# Altium schematic sheet Battery Pack + Protection.SchDoc
size A; SheetNumber: 2; SheetTotal: 5
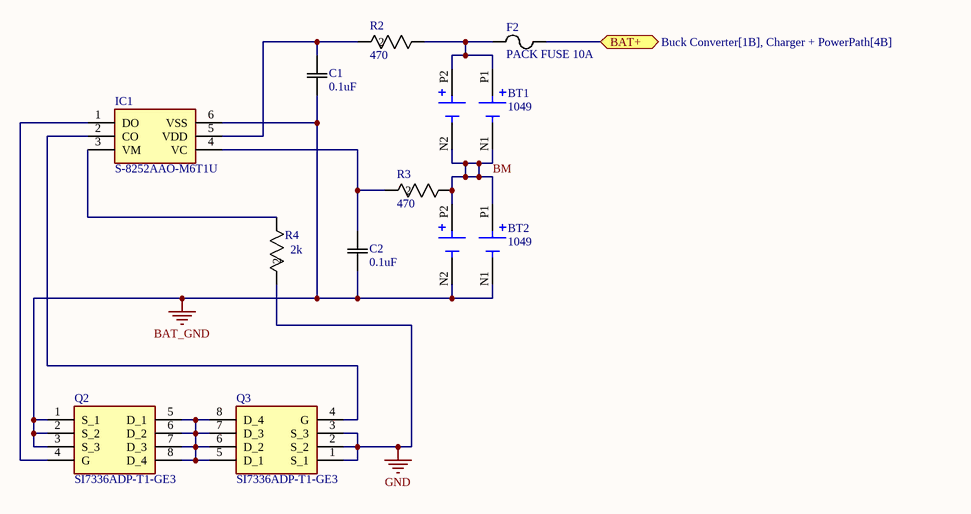
[diagram p0: Battery Pack + Protection.SchDoc]

## Parts
BT1  1049  [BAT_1049]
BT2  1049  [BAT_1049]
C1  0.1uF  [CAPC220145_88N_KEM]
C2  0.1uF  [CAPC220145_88N_KEM]
F2  PACK FUSE 10A  [FUSE_2920L70012_LTF]
IC1  S-8252AAO-M6T1U  [SOT95P275X135-6N]
Q2  SI7336ADP-T1-GE3  [SI7141DPT1GE3]
Q3  SI7336ADP-T1-GE3  [SI7141DPT1GE3]
R2  470  [RC0805N_YAG]
R3  470  [RC0805N_YAG]
R4  2k  [RC0805N_YAG]

## Ports
BAT+ (bidir, see Buck Converter[1B], Charger + PowerPath[4B])

## Nets
BAT_GND: BT2.N1(NEG1) BT2.N2(NEG2) C1.1 C2.1 IC1.6(VSS) Q2.1(S_1) Q2.2(S_2) Q2.3(S_3)
GND: Q3.1(S_1) Q3.2(S_2) Q3.3(S_3) R4.2
BAT+: F2.2 ; port BAT+
BM: BT1.N1(NEG1) BT1.N2(NEG2) BT2.P1(POS1) BT2.P2(POS2) R3.1
NetBT1_P1: BT1.P1(POS1) BT1.P2(POS2) F2.1 R2.1
NetC1_2: C1.2 IC1.5(VDD) R2.2
NetC2_2: C2.2 IC1.4(VC) R3.2
NetIC1_1: IC1.1(DO) Q2.4(G)
NetIC1_2: IC1.2(CO) Q3.4(G)
NetIC1_3: IC1.3(VM) R4.1
NetQ2_5: Q2.5(D_1) Q2.6(D_2) Q2.7(D_3) Q2.8(D_4) Q3.5(D_1) Q3.6(D_2) Q3.7(D_3) Q3.8(D_4)

## Library data of the parts
BT1 BT2 = 1049: THM Holder for Dual 18650 Batteries; MF: Keystone Electronics; SnapEDA_Link: https://www.snapeda.com/parts/1049/Keystone/view-part/?ref=snap; Package: None; Value: *; MP: 1049; Check_prices: https://www.snapeda.com/parts/1049/Keystone/view-part/?ref=eda
C1 C2 = C0805C104K5RACTU: SMD Comm X7R, Ceramic, 0.1 uF, 10%, 50 VDC, X7R, SMD, MLCC, Temperature Stable, Class II, 0805; Manufacturer_Name: Kemet; Copyright: Copyright (C) 2025 Ultra Librarian. All rights reserved.; Manufacturer_Part_Number: C0805C104K5RACTU
F2 = 2920L70012MR-A: Description; Manufacturer_Name: Littelfuse Inc; Manufacturer_Part_Number: 2920L700/12MR-A; Copyright: Copyright (C) 2025 Ultra Librarian. All rights reserved.
IC1 = S-8252AAO-M6T1U: Integrated Circuit; Manufacturer_Name: ABLIC Inc.; Datasheet Link: https://mouser.componentsearchengine.com/Datasheets/1/S-8252AAO-M6T1U.pdf; Height: 1.35mm; Manufacturer_Part_Number: S-8252AAO-M6T1U; Mouser Part Number: 628-S-8252AAO-M6T1U; Mouser Price/Stock: https://www.mouser.co.uk/ProductDetail/ABLIC/S-8252AAO-M6T1U?qs=Zq5ylnUbLm4MVa2IWcZcAw%3D%3D
Q2 Q3 = SI7336ADP-T1-GE3: MOSFET (N-Channel); Manufacturer_Name: Vishay; Datasheet Link: https://www.vishay.com/docs/73152/si7336adp.pdf; Manufacturer_Part_Number: SI7336ADP-T1-GE3; Mouser Part Number: 781-SI7336ADP-GE3; Mouser Price/Stock: https://www.mouser.co.uk/ProductDetail/Vishay-Semiconductors/SI7336ADP-T1-GE3?qs=rsuNcXF5LUYW4GWPNOtlwQ%3D%3D; Arrow Part Number: SI7336ADP-T1-GE3; Arrow Price/Stock: https://www.arrow.com/en/products/si7336adp-t1-ge3/vishay
R2 R3 = RC0805FR-07470RL: Description; Manufacturer_Name: Yageo; Copyright: Copyright (C) 2025 Ultra Librarian. All rights reserved.; Manufacturer_Part_Number: RC0805FR-07470RL
R4 = RT0805FRE072KL: No Description Available; Manufacturer_Name: Yageo; Copyright: Copyright (C) 2025 Ultra Librarian. All rights reserved.; Manufacturer_Part_Number: RT0805FRE072KL